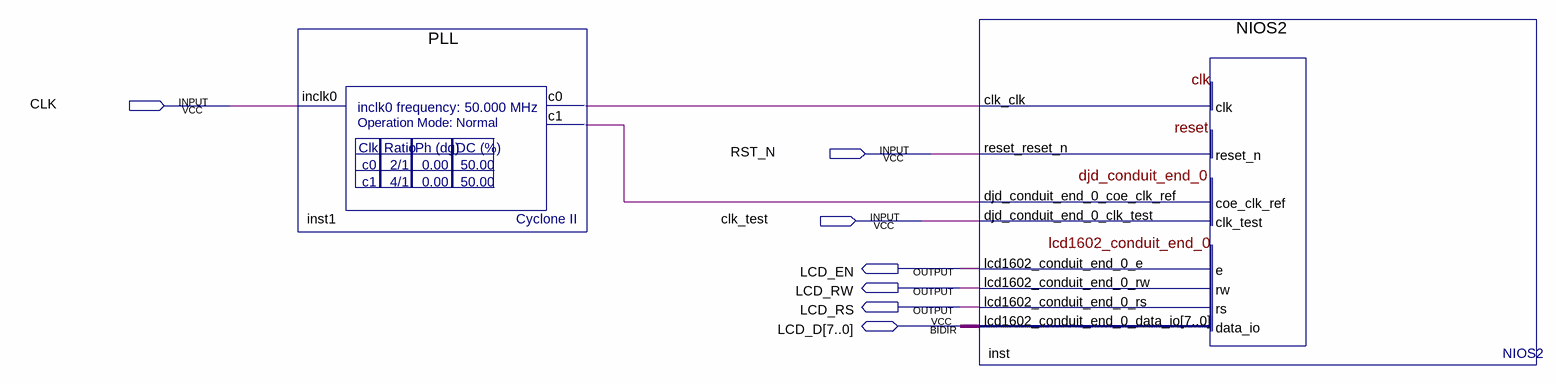
[diagram p0: schematic sheet]
// Quartus schematic djd.bdf as structural Verilog: 2 symbols, 7 pins
module djd (
  input  CLK,
  input  RST_N,
  input  clk_test,
  inout  [7:0] LCD_D,
  output LCD_EN,
  output LCD_RW,
  output LCD_RS
);

  wire inst1_c0, inst1_c1;

  PLL inst1 (.inclk0(CLK), .c0(inst1_c0), .c1(inst1_c1));
  NIOS2 inst (
    .clk_clk(inst1_c0), .reset_reset_n(RST_N), .djd_conduit_end_0_coe_clk_ref(inst1_c1),
    .djd_conduit_end_0_clk_test(clk_test), .lcd1602_conduit_end_0_e(LCD_EN),
    .lcd1602_conduit_end_0_rw(LCD_RW), .lcd1602_conduit_end_0_rs(LCD_RS),
    .lcd1602_conduit_end_0_data_io(LCD_D));
endmodule
